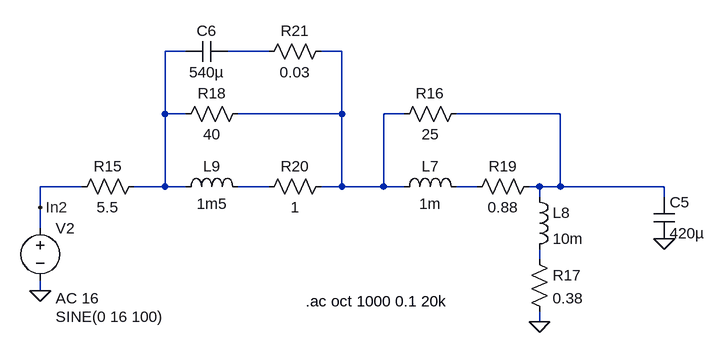
[diagram p0: schematic Loadbox.asc]
Loadbox.asc, the LTspice schematic file:
Version 4
SHEET 1 1784 844
WIRE -1488 -32 -1520 -32
WIRE -1360 -32 -1424 -32
WIRE -1248 -32 -1280 -32
WIRE -1520 64 -1520 -32
WIRE -1488 64 -1520 64
WIRE -1248 64 -1248 -32
WIRE -1248 64 -1408 64
WIRE -1152 64 -1184 64
WIRE -912 64 -1072 64
WIRE -1648 176 -1712 176
WIRE -1520 176 -1520 64
WIRE -1520 176 -1568 176
WIRE -1488 176 -1520 176
WIRE -1360 176 -1408 176
WIRE -1248 176 -1248 64
WIRE -1248 176 -1280 176
WIRE -1184 176 -1184 64
WIRE -1184 176 -1248 176
WIRE -1152 176 -1184 176
WIRE -1040 176 -1072 176
WIRE -944 176 -960 176
WIRE -912 176 -912 64
WIRE -912 176 -944 176
WIRE -752 176 -912 176
WIRE -944 192 -944 176
WIRE -752 192 -752 176
WIRE -1712 208 -1712 176
WIRE -1712 240 -1712 208
WIRE -944 288 -944 272
WIRE -1712 336 -1712 320
WIRE -944 384 -944 368
FLAG -944 384 0
FLAG -752 256 0
FLAG -1712 208 In2
FLAG -1712 336 0
SYMBOL res -1552 160 R90
WINDOW 0 0 56 VBottom 2
WINDOW 3 32 56 VTop 2
SYMATTR InstName R15
SYMATTR Value 5.5
SYMBOL ind -1168 192 R270
WINDOW 0 32 56 VTop 2
WINDOW 3 5 56 VBottom 2
SYMATTR InstName L7
SYMATTR Value 1m
SYMBOL res -1056 48 R90
WINDOW 0 0 56 VBottom 2
WINDOW 3 32 56 VTop 2
SYMATTR InstName R16
SYMATTR Value 25
SYMBOL ind -960 176 R0
SYMATTR InstName L8
SYMATTR Value 10m
SYMBOL res -960 272 R0
SYMATTR InstName R17
SYMATTR Value 0.38
SYMBOL cap -768 192 R0
SYMATTR InstName C5
SYMATTR Value 420µ
SYMBOL ind -1504 192 R270
WINDOW 0 32 56 VTop 2
WINDOW 3 5 56 VBottom 2
SYMATTR InstName L9
SYMATTR Value 1m5
SYMBOL res -1392 48 R90
WINDOW 0 0 56 VBottom 2
WINDOW 3 32 56 VTop 2
SYMATTR InstName R18
SYMATTR Value 40
SYMBOL cap -1424 -48 R90
WINDOW 0 0 32 VBottom 2
WINDOW 3 32 32 VTop 2
SYMATTR InstName C6
SYMATTR Value 540µ
SYMBOL res -944 160 R90
WINDOW 0 0 56 VBottom 2
WINDOW 3 32 56 VTop 2
SYMATTR InstName R19
SYMATTR Value 0.88
SYMBOL res -1264 160 R90
WINDOW 0 0 56 VBottom 2
WINDOW 3 32 56 VTop 2
SYMATTR InstName R20
SYMATTR Value 1
SYMBOL res -1264 -48 R90
WINDOW 0 0 56 VBottom 2
WINDOW 3 32 56 VTop 2
SYMATTR InstName R21
SYMATTR Value 0.03
SYMBOL voltage -1712 224 R0
WINDOW 3 24 152 Left 2
WINDOW 123 24 124 Left 2
WINDOW 39 0 0 Left 0
SYMATTR Value SINE(0 16 100)
SYMATTR Value2 AC 16
SYMATTR InstName V2
TEXT -1304 352 Left 2 !.ac oct 1000 0.1 20k

The netlist it stands for:
* Loadbox.asc
R15 N001 In2 5.5
L7 N003 N006 1m
R16 N004 N003 25
L8 N004 N007 10m
R17 N007 0 0.38
C5 N004 0 420µ
L9 N001 N005 1m5
R18 N003 N001 40
C6 N002 N001 540µ
R19 N004 N006 0.88
R20 N003 N005 1
R21 N003 N002 0.03
V2 In2 0 SINE(0 16 100) AC 16
.ac oct 1000 0.1 20k
.backanno
.end